# Altium schematic sheet Power.SchDoc
size A4
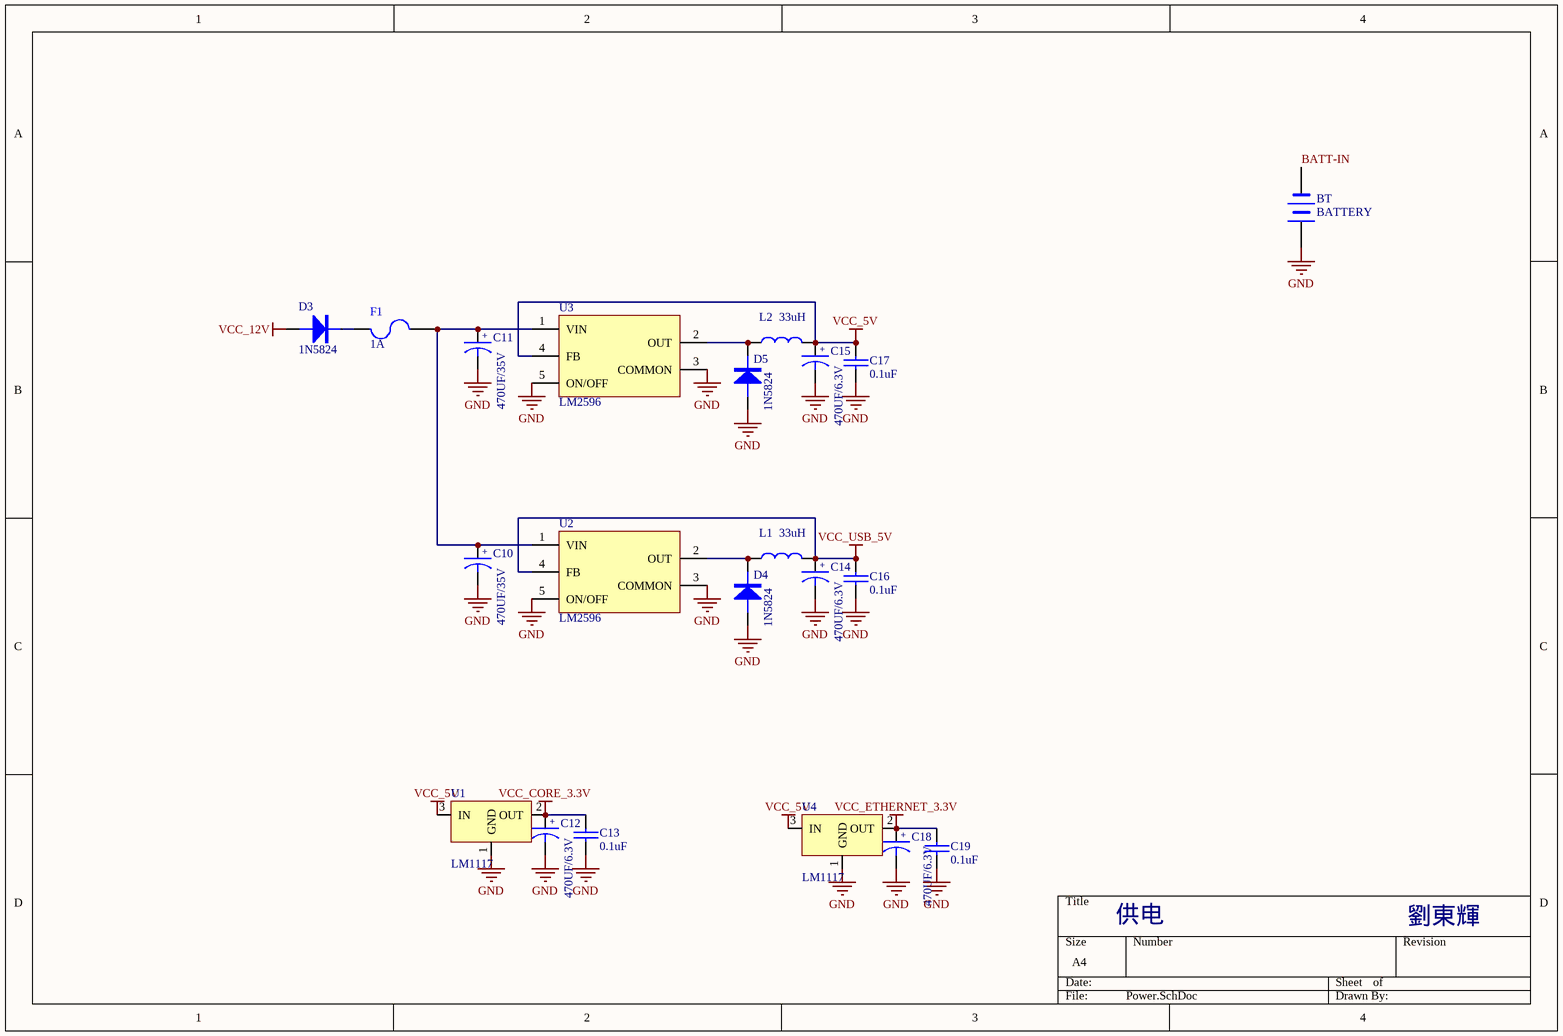
[diagram p0: Power.SchDoc]

## Parts
BT  BATTERY  [CR-1220]
C10  470UF/35V  [SMT_10X10_3-AECAP]
C11  470UF/35V  [SMT_10X10_3-AECAP]
C12  470UF/6.3V  [SMT_6_3X7_7-AECAP]
C13  0.1uF  [0805/2012 C3]
C14  470UF/6.3V  [SMT_6_3X7_7-AECAP]
C15  470UF/6.3V  [SMT_6_3X7_7-AECAP]
C16  0.1uF  [0805/2012 C3]
C17  0.1uF  [0805/2012 C3]
C18  470UF/6.3V  [SMT_6_3X7_7-AECAP]
C19  0.1uF  [0805/2012 C3]
D3  1N5824  [DO-214AC]
D4  1N5824  [DO-214AC]
D5  1N5824  [DO-214AC]
F1  1A  [FUSR_BOURNS_MF-MSMF_STYLE1(H85)]
L1  33uH  [MS125]
L2  33uH  [MS125]
U1  LM1117  [SOT-223]
U2  LM2596  [TO-263-B]
U3  LM2596  [TO-263-B]
U4  LM1117  [SOT-223]

## Nets
GND: BT.1(+) C10.2 C11.2 C12.2 C13.2 C14.2 C15.2 C16.2 C17.2 C18.2 C19.2 D4.1(A) D5.1(A) U1.1(GND) U2.0(GND) U2.3(COMMON) U2.5(ON/OFF) U3.0(GND) U3.3(COMMON) U3.5(ON/OFF) U4.1(GND)
VCC_5V: C15.1 C17.1 L2.1 U1.3(IN) U3.4(FB) U4.3(IN)
VCC_12V: D3.1(A)
VCC_CORE_3.3V: C12.1 C13.1 U1.2(OUT) U1.4(VCC_CORE_3.3V)
VCC_ETHERNET_3.3V: C18.1 C19.1 U4.2(OUT) U4.4(VCC_ETHERNET_3.3V)
VCC_USB_5V: C14.1 C16.1 L1.1 U2.4(FB)
BATT-IN: BT.2(-)
NetC10_1: C10.1 C11.1 F1.1 U2.1(VIN) U3.1(VIN)
NetD3_2: D3.2(K) F1.2
NetD4_2: D4.2(K) L1.2 U2.2(OUT)
NetD5_2: D5.2(K) L2.2 U3.2(OUT)

## Notes on the sheet
- 供电
- 劉東輝
- (in symbol 10UF/10V) +

## Library data of the parts
BT = BATTERY: pin to pad: 1>2 2>1
C10-C12 C14 C15 C18 = 10UF/10V: CCTC-106K010
C13 C16 C17 C19 = Pro39.tmp_22P_32
D3-D5 = 1N5819: CD-1N5819-DO41
F1 = Fuse 2: Fuse; Published: 8-Jun-2000; LatestRevisionDate: 17-Jul-2002; LatestRevisionNote: Re-released for DXP Platform.; PackageReference: PIN-W2/E2.8; Publisher: Altium Limited
L1 L2 = 100UH-SLF7032: CL-SLF7032-101
U2 U3 = LM2596: CI-LM2575T-5.0